# EAGLE schematic modem-v1-rev1 (EAGLE 7.2.0)
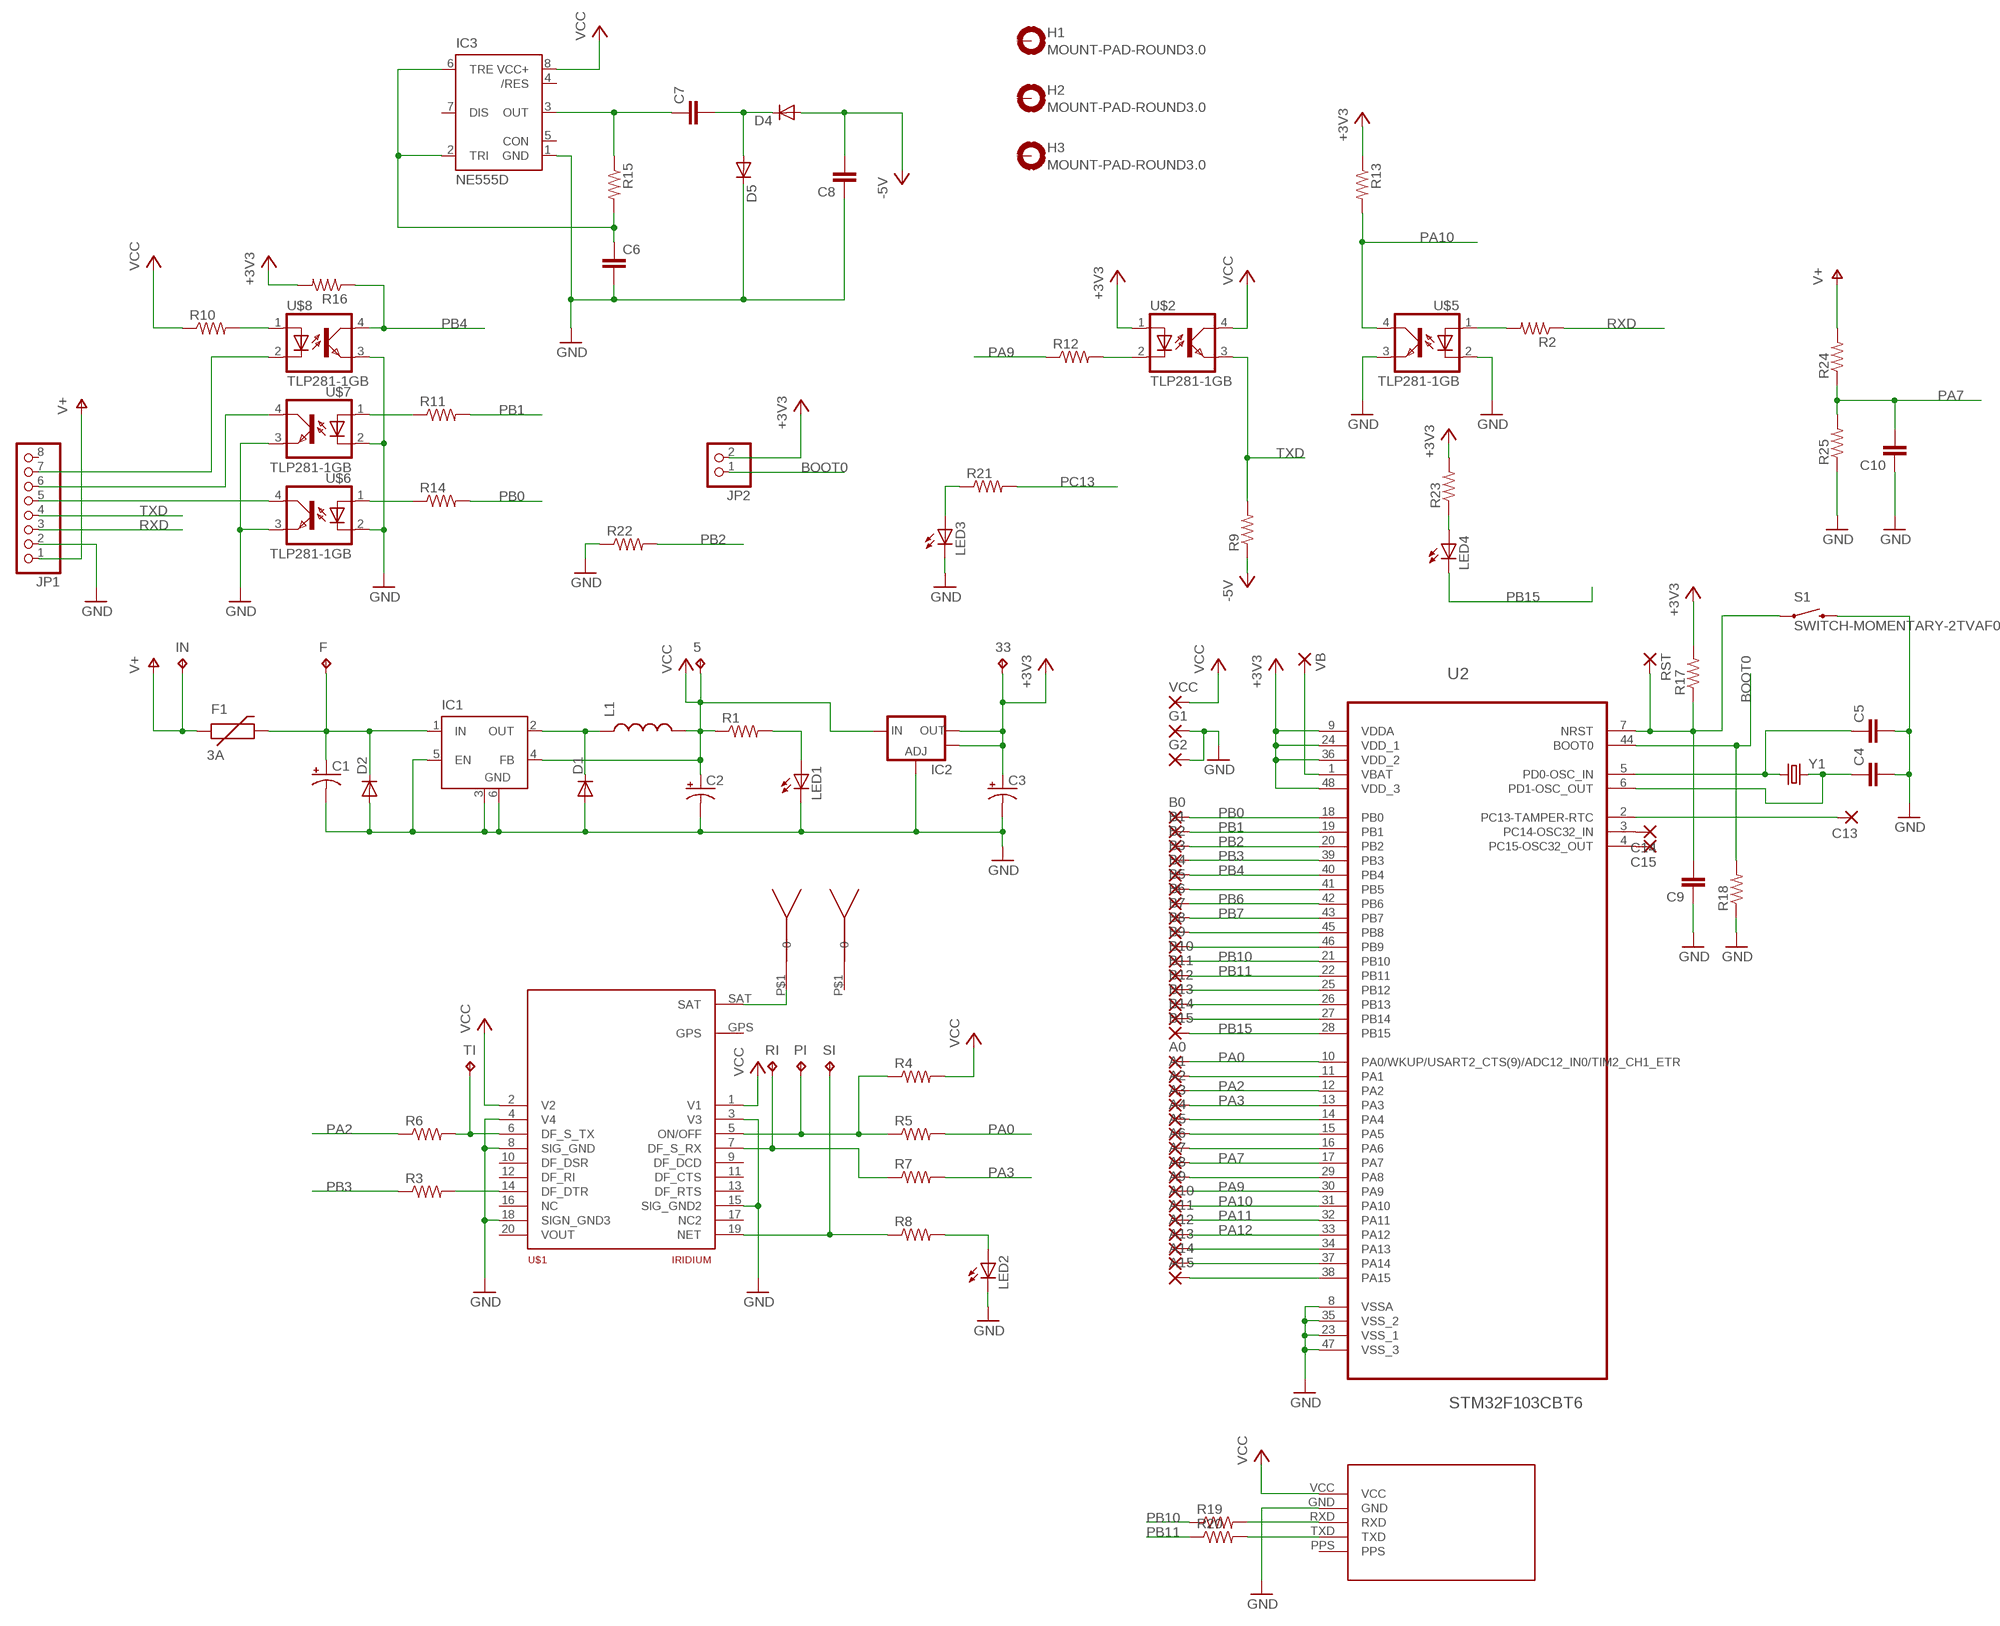
[diagram p0: schematic, sheet 1]

## Parts
5  TPTP15R  [TP15R]
33  TP1  TPTP15R  [TP15R]
A0  1,6/0,8  [1,6/0,8]
A1  1,6/0,8  [1,6/0,8]
A2  1,6/0,8  [1,6/0,8]
A3  1,6/0,8  [1,6/0,8]
A4  1,6/0,8  [1,6/0,8]
A5  1,6/0,8  [1,6/0,8]
A6  1,6/0,8  [1,6/0,8]
A7  1,6/0,8  [1,6/0,8]
A8  1,6/0,8  [1,6/0,8]
A9  1,6/0,8  [1,6/0,8]
A10  1,6/0,8  [1,6/0,8]
A11  1,6/0,8  [1,6/0,8]
A12  1,6/0,8  [1,6/0,8]
A13  1,6/0,8  [1,6/0,8]
A14  1,6/0,8  [1,6/0,8]
A15  1,6/0,8  [1,6/0,8]
B0  1,6/0,8  [1,6/0,8]
B1  1,6/0,8  [1,6/0,8]
B2  1,6/0,8  [1,6/0,8]
B3  1,6/0,8  [1,6/0,8]
B4  1,6/0,8  [1,6/0,8]
B5  1,6/0,8  [1,6/0,8]
B6  1,6/0,8  [1,6/0,8]
B7  1,6/0,8  [1,6/0,8]
B8  1,6/0,8  [1,6/0,8]
B9  1,6/0,8  [1,6/0,8]
B10  1,6/0,8  [1,6/0,8]
B11  1,6/0,8  [1,6/0,8]
B12  1,6/0,8  [1,6/0,8]
B13  1,6/0,8  [1,6/0,8]
B14  1,6/0,8  [1,6/0,8]
B15  1,6/0,8  [1,6/0,8]
C1  CAP_POLG  [PANASONIC_G]
C2  CAP_POLD  [PANASONIC_D]
C3  CAP_POLD  [PANASONIC_D]
C4  CAP0805  [0805]
C5  CAP0805  [0805]
C6  CAP0805  [0805]
C7  CAP0805  [0805]
C8  CAP0805  [0805]
C9  CAP0805  [0805]
C10  CAP0805  [0805]
C13  1,6/0,8  [1,6/0,8]
C14  1,6/0,8  [1,6/0,8]
C15  1,6/0,8  [1,6/0,8]
D1  DIODESMA-KIT  [SMA-DIODE-KIT]
D2  DIODESMB  [SMB-DIODE]
D4  DIODESOD  [SOD-323]
D5  DIODESOD  [SOD-323]
F  TPTP15R  [TP15R]
F1  3A  PTCPTH  [PTC]
G1  1,6/0,8  [1,6/0,8]
G2  1,6/0,8  [1,6/0,8]
H1  MOUNT-PAD-ROUND3.0  [3,0-PAD]
H2  MOUNT-PAD-ROUND3.0  [3,0-PAD]
H3  MOUNT-PAD-ROUND3.0  [3,0-PAD]
IC1  LM2596S  [TO263-5]
IC2  V_REG_LM1117SOT223  [SOT223]
IC3  NE555D  [SO08]
IN  IN  TPTP15R  [TP15R]
JP1  PINHD-1X8  [1X08]
JP2  PINHD-1X2  [1X02]
L1  INDUCTORPWR  [CDRH125]
LED1  LED-FKIT-1206  [FKIT-LED-1206]
LED2  LED-FKIT-1206  [FKIT-LED-1206]
LED3  LED-FKIT-1206  [FKIT-LED-1206]
LED4  LED-FKIT-1206  [FKIT-LED-1206]
PI  TPTP15R  [TP15R]
R1  RESISTOR0805-RES  [0805]
R2  RESISTOR0805-RES  [0805]
R3  RESISTOR0805-RES  [0805]
R4  RESISTOR0805-RES  [0805]
R5  RESISTOR0805-RES  [0805]
R6  RESISTOR0805-RES  [0805]
R7  RESISTOR0805-RES  [0805]
R8  RESISTOR0805-RES  [0805]
R9  RESISTOR0805-RES  [0805]
R10  RESISTOR0805-RES  [0805]
R11  RESISTOR0805-RES  [0805]
R12  RESISTOR0805-RES  [0805]
R13  RESISTOR0805-RES  [0805]
R14  RESISTOR0805-RES  [0805]
R15  RESISTOR0805-RES  [0805]
R16  RESISTOR0805-RES  [0805]
R17  RESISTOR0805-RES  [0805]
R18  RESISTOR0805-RES  [0805]
R19  RESISTOR0805-RES  [0805]
R20  RESISTOR0805-RES  [0805]
R21  RESISTOR0805-RES  [0805]
R22  RESISTOR0805-RES  [0805]
R23  RESISTOR0805-RES  [0805]
R24  RESISTOR0805-RES  [0805]
R25  RESISTOR0805-RES  [0805]
RI  TPTP15R  [TP15R]
RST  1,6/0,8  [1,6/0,8]
S1  SWITCH-MOMENTARY-2TVAF02  [TVAF02]
SI  TPTP15R  [TP15R]
TI  TPTP15R  [TP15R]
U1  UBLOX_NEO_6M  [NEO-6M]
U2  STM32F103CBT6  [QFP50P900X900X160-48N]
U$1  IRIDIUM-9602  [IRIDIUM-9602]
U$2  TLP281-1GB  [TLP281]
U$3  TAOGLASS-ANTENNA  [TAOGLASS-1]
U$4  TAOGLASS-ANTENNA  [TAOGLASS-1]
U$5  TLP281-1GB  [TLP281]
U$6  TLP281-1GB  [TLP281]
U$7  TLP281-1GB  [TLP281]
U$8  TLP281-1GB  [TLP281]
VB  1,6/0,8  [1,6/0,8]
VCC  1,6/0,8  [1,6/0,8]
Y1  CRYSTAL10.5X4.8  [CRYSTAL-SMD-10.5X4.8-2PIN]

## Nets
+3V3: 33.TP C3.+ IC2.2(OUT) IC2.4(OUT) JP2.2 R13.1 R16.2 R17.2 R23.2 U2.9(VDDA) U2.24(VDD_1) U2.36(VDD_2) U2.48(VDD_3) U$2.1(A)
-5V: C8.2 D4.2(A) R9.1
BOOT0: JP2.1 R18.2 U2.44(BOOT0)
GND: C1.- C2.- C3.- C4.2 C5.2 C6.2 C8.1 C9.1 C10.1 D1.A D2.A D5.1(C) G1.1(P) G2.1(P) IC1.3(GND) IC1.5(EN) IC1.6(GND) IC2.1(ADJ) IC3.1(GND) JP1.2 LED1.C LED2.C LED3.C R18.1 R22.1 R25.1 S1.1A U1.GND U2.8(VSSA) U2.23(VSS_1) U2.35(VSS_2) U2.47(VSS_3) U$1.3(V3) U$1.4(V4) U$1.8(SIG_GND) U$1.15(SIG_GND2) U$1.18(SIGN_GND3) U$5.2(C) U$5.3(EMIT) U$6.2(C) U$6.3(EMIT) U$7.2(C) U$7.3(EMIT) U$8.3(EMIT)
N$1: C1.+ D2.C F1.P$2 F.TP IC1.1(IN)
N$2: R12.2 U$2.2(C)
N$3: D1.C IC1.2(OUT) L1.1
N$4: C7.1 IC3.3(OUT) R15.1
N$5: LED1.A R1.2
N$6: R2.2 U$5.1(A)
N$7: R3.2 U$1.14(DF_DTR)
N$8: R6.2 TI.TP U$1.6(DF_S_TX)
N$9: R7.1 RI.TP U$1.7(DF_S_RX)
N$10: U$1.SAT U$3.P$1
N$11: PI.TP R4.1 R5.1 U$1.5(ON/OFF)
N$12: R8.1 SI.TP U$1.19(NET)
N$13: C5.1 U2.5(PD0-OSC_IN) Y1.P$1
N$14: C4.1 U2.6(PD1-OSC_OUT) Y1.P$2
N$15: LED2.A R8.2
N$16: JP1.5 U$6.4(COL)
N$17: JP1.6 U$7.4(COL)
N$18: JP1.7 U$8.2(C)
N$19: R10.2 U$8.1(A)
N$20: R11.1 U$7.1(A)
N$21: C6.1 IC3.2(TRI) IC3.6(TRE) R15.2
N$22: R14.1 U$6.1(A)
N$23: C7.2 D4.1(C) D5.2(A)
N$24: C15.1(P) U2.4(PC15-OSC32_OUT)
N$25: C14.1(P) U2.3(PC14-OSC32_IN)
N$26: R19.2 U1.RXD
N$27: R20.2 U1.TXD
N$28: LED3.A R21.1
N$29: U2.1(VBAT) VB.1(P)
N$30: LED4.A R23.1
N$31: B5.1(P) U2.41(PB5)
N$32: B8.1(P) U2.45(PB8)
N$33: B9.1(P) U2.46(PB9)
N$34: B12.1(P) U2.25(PB12)
N$35: B13.1(P) U2.26(PB13)
N$36: B14.1(P) U2.27(PB14)
N$38: A1.1(P) U2.11(PA1)
N$39: A4.1(P) U2.14(PA4)
N$40: A5.1(P) U2.15(PA5)
N$41: A6.1(P) U2.16(PA6)
N$43: A8.1(P) U2.29(PA8)
N$44: A13.1(P) U2.34(PA13)
N$45: A14.1(P) U2.37(PA14)
N$46: A15.1(P) U2.38(PA15)
N$50: C9.2 R17.1 RST.1(P) S1.1B U2.7(NRST)
PA0: A0.1(P) R5.2 U2.10(PA0/WKUP/USART2_CTS(9)/ADC12_IN0/TIM2_CH1_ETR)
PA2: A2.1(P) R6.1 U2.12(PA2)
PA3: A3.1(P) R7.2 U2.13(PA3)
PA7: A7.1(P) C10.2 R24.1 R25.2 U2.17(PA7)
PA9: A9.1(P) R12.1 U2.30(PA9)
PA10: A10.1(P) R13.2 U2.31(PA10) U$5.4(COL)
PA11: A11.1(P) U2.32(PA11)
PA12: A12.1(P) U2.33(PA12)
PB0: B0.1(P) R14.2 U2.18(PB0)
PB1: B1.1(P) R11.2 U2.19(PB1)
PB2: B2.1(P) R22.2 U2.20(PB2)
PB3: B3.1(P) R3.1 U2.39(PB3)
PB4: B4.1(P) R16.1 U2.40(PB4) U$8.4(COL)
PB6: B6.1(P) U2.42(PB6)
PB7: B7.1(P) U2.43(PB7)
PB10: B10.1(P) R19.1 U2.21(PB10)
PB11: B11.1(P) R20.1 U2.22(PB11)
PB15: B15.1(P) LED4.C U2.28(PB15)
PC13: C13.1(P) R21.2 U2.2(PC13-TAMPER-RTC)
RXD: JP1.3 R2.1
TXD: JP1.4 R9.2 U$2.3(EMIT)
V+: F1.P$1 IN.TP JP1.1 R24.2
VCC: 5.TP C2.+ IC1.4(FB) IC2.3(IN) IC3.8(VCC+) L1.2 R1.1 R4.2 R10.1 U1.VCC U$1.1(V1) U$1.2(V2) U$2.4(COL) VCC.1(P)
Unconnected: H1.B3,0(MOUNT) H2.B3,0(MOUNT) H3.B3,0(MOUNT) IC3.4(/RES) IC3.5(CON) IC3.7(DIS) JP1.8 U1.PPS U$1.9(DF_DCD) U$1.10(DF_DSR) U$1.11(DF_CTS) U$1.12(DF_RI) U$1.13(DF_RTS) U$1.16(NC) U$1.17(NC2) U$1.20(VOUT) U$1.GPS U$4.P$1

## Library data of the parts
5 33 F IN PI RI SI TI = testpad:TP: Test pad
A0 A1-A15 B0 B1-B15 C13-C15 G1 G2 RST VB VCC = wirepad:1,6/0,8: THROUGH-HOLE PAD
C1-C3 = SparkFun:CAP_POL: Capacitor Polarized These are standard SMD and PTH capacitors. Normally 10uF, 47uF, and 100uF in electrolytic and tantalum varieties. Always verify the external diameter of the through hole cap, it varies with capacity, voltage, and manufacturer. The EIA devices should be standard.
C4-C10 = SparkFun:CAP: Capacitor Standard 0603 ceramic capacitor, and 0.1" leaded capacitor.
D1 D2 D4 D5 = SparkFun:DIODE: Diode These are standard reverse protection diodes and small signal diodes. SMA package can handle up to about 1A. SOD-323 can handle about 200mA. What the SOD-323 package when ordering, there are some mfgs out there that are 5-pin packages.
F1 = SparkFun:PTC: Resettable Fuse PTC Resettable Fuse. Spark Fun Electronics SKU : COM-08357
H1-H3 = holes:MOUNT-PAD-ROUND: MOUNTING PAD, round
IC1 = linear:LM2596S: STEP-DOWN VOLTAGE REGULATOR
IC2 = SparkFun:V_REG_LM1117: Voltage Regulator LM1117 Standard adjustable voltage regulator but in SMD form. Spark Fun Electronics SKU : COM-00595
IC3 = SparkFun:NE555: General purpose bipolar Timer
JP1 = pinhead:PINHD-1X8: PIN HEADER
JP2 = pinhead:PINHD-1X2: PIN HEADER
L1 = SparkFun:INDUCTOR: Inductors Basic Inductor/Choke - 0603 and 1206. Footprints are not proven and vary greatly between part numbers.
LED1-LED4 = SparkFun:LED: LEDs Standard schematic elements and footprints for 5mm, 3mm, 1206, and 0603 sized LEDs. 5mm - Spark Fun Electronics SKU : COM-00529 (and others)
R1-R25 = SparkFun:RESISTOR: Resistor Basic schematic elements and footprints for 0603, 1206, and PTH resistors.
S1 = SparkFun:SWITCH-MOMENTARY-2
U1 = t46:UBLOX_NEO_6M
U2 = STMicroelctronics:STM32F103CBT6: Medium-density performance line ARM-based 32-bit MCU; MPN: STM32F103CBT6; OC_FARNELL: 1606327; OC_NEWARK: 11N8296; PACKAGE: QFP-48; SUPPLIER: STMICROELECTRONICS
U$1 = t46:IRIDIUM-9602
U$2 U$5-U$8 = t46:TLP281-1GB
U$3 U$4 = t46:TAOGLASS-ANTENNA
Y1 = SparkFun:CRYSTAL: Crystals Various standard crystals. Proven footprints. Spark Fun Electronics SKU : COM-00534